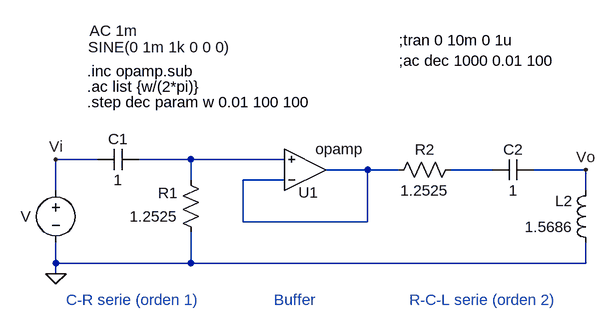
[diagram p0: schematic TS4_pasivo.asc]
TS4_pasivo.asc, the LTspice schematic file:
Version 4
SHEET 1 1088 728
WIRE 48 160 -16 160
WIRE 192 160 112 160
WIRE 336 160 192 160
WIRE 464 176 400 176
WIRE 512 176 464 176
WIRE 656 176 592 176
WIRE 800 176 720 176
WIRE 192 192 192 160
WIRE 336 192 272 192
WIRE -16 208 -16 160
WIRE 800 208 800 176
WIRE 272 256 272 192
WIRE 464 256 464 176
WIRE 464 256 272 256
WIRE -16 320 -16 288
WIRE 192 320 192 272
WIRE 192 320 -16 320
WIRE 800 320 800 288
WIRE 800 320 192 320
WIRE -16 336 -16 320
FLAG -16 160 Vi
FLAG 800 176 Vo
FLAG -16 336 0
SYMBOL voltage -16 192 R0
WINDOW 123 52 -230 Left 2
WINDOW 39 0 0 Left 2
WINDOW 0 -54 56 Left 2
WINDOW 3 50 -205 Left 2
SYMATTR Value2 AC 1m
SYMATTR InstName V
SYMATTR Value SINE(0 1m 1k 0 0 0)
SYMBOL res 208 288 R180
WINDOW 0 36 76 Left 2
WINDOW 3 36 40 Left 2
SYMATTR InstName R1
SYMATTR Value 1.2525
SYMBOL cap 48 176 R270
WINDOW 0 32 32 VTop 2
WINDOW 3 0 32 VBottom 2
SYMATTR InstName C1
SYMATTR Value 1
SYMBOL Opamps\\opamp 368 240 M180
WINDOW 0 20 29 Right 2
SYMATTR InstName U1
SYMBOL cap 656 192 R270
WINDOW 0 32 32 VTop 2
WINDOW 3 0 32 VBottom 2
SYMATTR InstName C2
SYMATTR Value 1
SYMBOL res 608 160 R90
WINDOW 0 0 56 VBottom 2
WINDOW 3 32 56 VTop 2
SYMATTR InstName R2
SYMATTR Value 1.2525
SYMBOL ind 816 304 R180
WINDOW 0 36 80 Left 2
WINDOW 3 36 40 Left 2
SYMATTR InstName L2
SYMATTR Value 1.5686
TEXT 512 -24 Left 2 !;tran 0 10m 0 1u
TEXT 512 8 Left 2 !;ac dec 1000 0.01 100
TEXT 32 72 Left 2 !.step dec param w 0.01 100 100
TEXT 32 48 Left 2 !.ac list {w/(2*pi)}
TEXT 32 24 Left 2 !.inc opamp.sub
TEXT 0 376 Left 2 ;C-R serie (orden 1)
TEXT 320 376 Left 2 ;Buffer
TEXT 528 376 Left 2 ;R-C-L serie (orden 2)

The netlist it stands for:
* TS4_pasivo.asc
V Vi 0 SINE(0 1m 1k 0 0 0) AC 1m
R1 0 N001 1.2525
C1 Vi N001 1
XU1 N002 N001 N002 opamp Aol=100K GBW=10Meg  ; pins invin noninvin out
C2 N003 Vo 1
R2 N003 N002 1.2525
L2 0 Vo 1.5686
;tran 0 10m 0 1u
;ac dec 1000 0.01 100
.step dec param w 0.01 100 100
.ac list {w/(2*pi)}
.inc opamp.sub
* C-R serie (orden 1)
* Buffer
* R-C-L serie (orden 2)
.backanno
.end